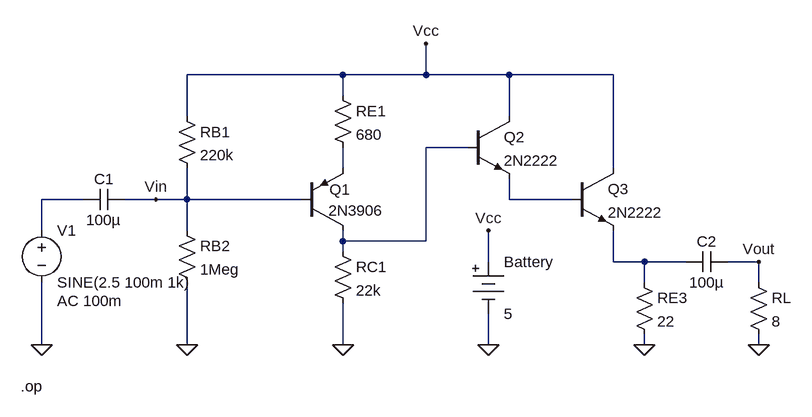
[diagram p0: schematic Test3.asc]
Test3.asc, the LTspice schematic file:
Version 4
SHEET 1 1428 680
WIRE 608 112 368 112
WIRE 736 112 736 64
WIRE 736 112 608 112
WIRE 864 112 736 112
WIRE 1024 112 864 112
WIRE 608 144 608 112
WIRE 368 176 368 112
WIRE 864 176 864 112
WIRE 800 224 736 224
WIRE 608 256 608 224
WIRE 1024 256 1024 112
WIRE 208 304 144 304
WIRE 320 304 272 304
WIRE 368 304 368 256
WIRE 368 304 320 304
WIRE 544 304 368 304
WIRE 864 304 864 272
WIRE 960 304 864 304
WIRE 144 352 144 304
WIRE 368 352 368 304
WIRE 608 368 608 352
WIRE 736 368 736 224
WIRE 736 368 608 368
WIRE 608 384 608 368
WIRE 832 400 832 352
WIRE 1024 400 1024 352
WIRE 1072 400 1024 400
WIRE 1136 400 1072 400
WIRE 1248 400 1200 400
WIRE 1072 432 1072 400
WIRE 1248 432 1248 400
WIRE 144 528 144 432
WIRE 368 528 368 432
WIRE 608 528 608 464
WIRE 832 528 832 480
WIRE 1072 528 1072 512
WIRE 1248 528 1248 512
FLAG 144 528 0
FLAG 368 528 0
FLAG 608 528 0
FLAG 1072 528 0
FLAG 1248 528 0
FLAG 736 64 Vcc
FLAG 832 352 Vcc
FLAG 832 528 0
FLAG 320 304 Vin
FLAG 1248 400 Vout
SYMBOL voltage 144 336 R0
WINDOW 123 24 124 Left 2
WINDOW 39 0 0 Left 0
SYMATTR Value2 AC 100m
SYMATTR InstName V1
SYMATTR Value SINE(2.5 100m 1k)
SYMBOL cap 272 288 R90
WINDOW 0 0 32 VBottom 2
WINDOW 3 32 32 VTop 2
SYMATTR InstName C1
SYMATTR Value 100µ
SYMBOL res 352 160 R0
SYMATTR InstName RB1
SYMATTR Value 220k
SYMBOL res 352 336 R0
SYMATTR InstName RB2
SYMATTR Value 1Meg
SYMBOL res 592 128 R0
SYMATTR InstName RE1
SYMATTR Value 680
SYMBOL res 592 368 R0
SYMATTR InstName RC1
SYMATTR Value 22k
SYMBOL npn 800 176 R0
SYMATTR InstName Q2
SYMATTR Value 2N2222
SYMBOL npn 960 256 R0
SYMATTR InstName Q3
SYMATTR Value 2N2222
SYMBOL cap 1200 384 R90
WINDOW 0 0 32 VBottom 2
WINDOW 3 32 32 VTop 2
SYMATTR InstName C2
SYMATTR Value 100µ
SYMBOL res 1056 416 R0
SYMATTR InstName RE3
SYMATTR Value 22
SYMBOL res 1232 416 R0
SYMATTR InstName RL
SYMATTR Value 8
SYMBOL Misc\\battery 832 384 R0
WINDOW 123 0 0 Left 0
WINDOW 39 0 0 Left 0
SYMATTR InstName Battery
SYMATTR Value 5
SYMBOL pnp 544 352 M180
WINDOW 0 43 63 Left 2
WINDOW 3 42 31 Left 2
SYMATTR InstName Q1
SYMATTR Value 2N3906
TEXT 112 592 Left 2 !.op

The netlist it stands for:
* Test3.asc
V1 N003 0 SINE(2.5 100m 1k) AC 100m
C1 Vin N003 100µ
RB1 Vcc Vin 220k
RB2 Vin 0 1Meg
RE1 Vcc N002 680
RC1 N001 0 22k
Q2 Vcc N001 N004 0 2N2222
Q3 Vcc N004 N005 0 2N2222
C2 Vout N005 100µ
RE3 N005 0 22
RL Vout 0 8
V§Battery Vcc 0 5
Q1 N001 Vin N002 0 2N3906
.model NPN NPN
.model PNP PNP
.lib standard.bjt
.op
.backanno
.end